# EAGLE design STM_BLOCK (EAGLE 8.6.1)
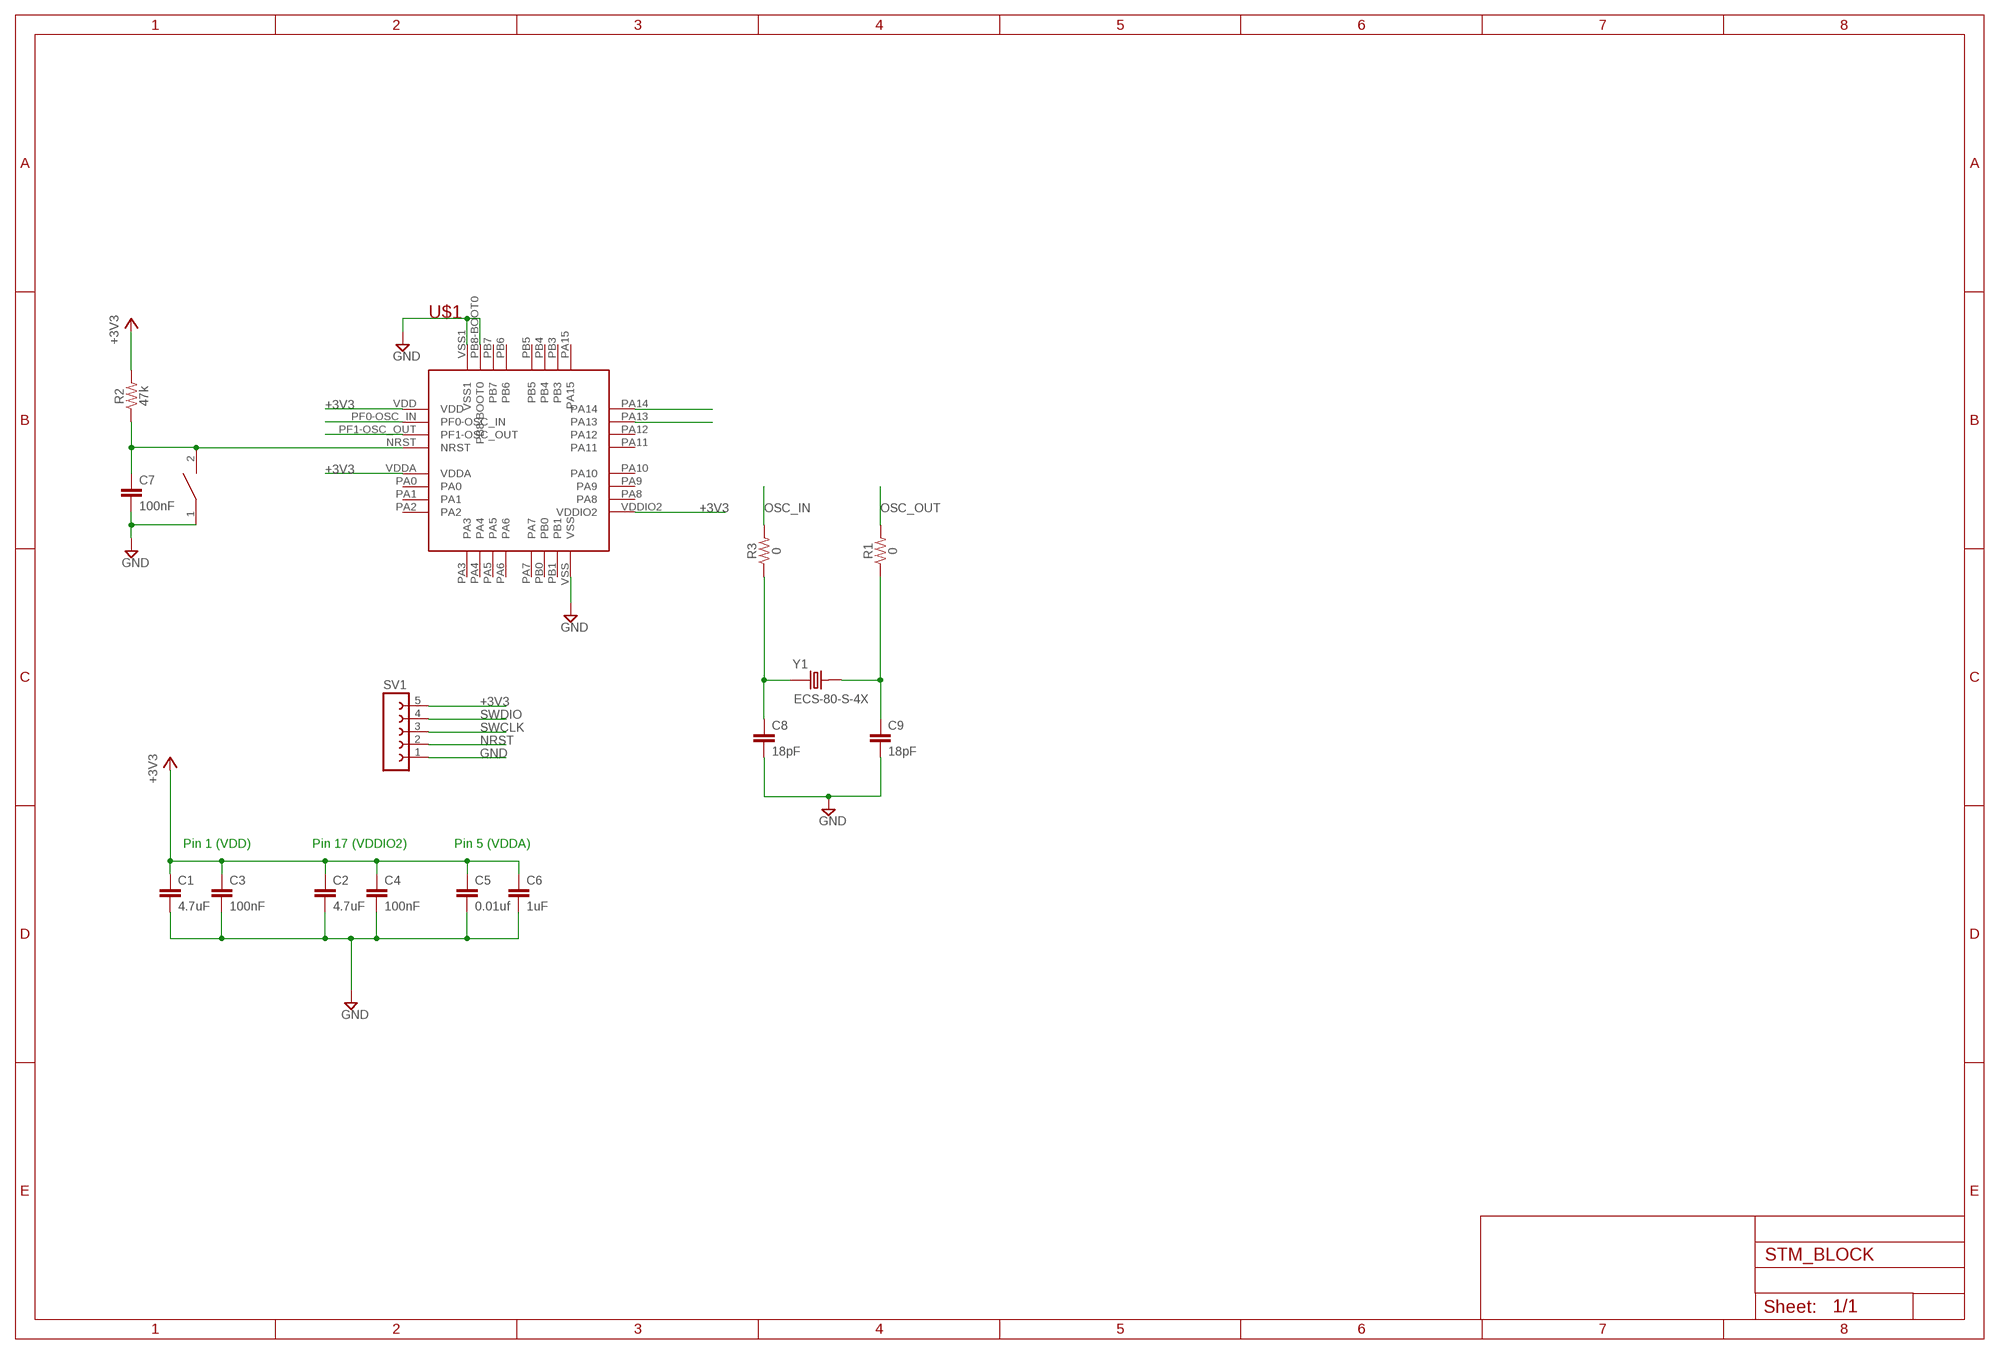
[diagram p0: schematic, sheet 1]

## Parts
C1  4.7uF  4.7UF0603  [0603]
C2  4.7uF  4.7UF0603  [0603]
C3  100nF  4.7UF0603  [0603]
C4  100nF  4.7UF0603  [0603]
C5  0.01uf  4.7UF0603  [0603]
C6  1uF  4.7UF0603  [0603]
C7  100nF  4.7UF0603  [0603]
C8  18pF  4.7UF0603  [0603]
C9  18pF  4.7UF0603  [0603]
R1  0  1KOHM-0603-1/10W-1%  [0603]
R2  47k  1KOHM-0603-1/10W-1%  [0603]
R3  0  1KOHM-0603-1/10W-1%  [0603]
RESET  SWITCH  [SW_2512]
SV1  FE05-1  [FE05-1]
U$1  STM32F042K6T6  [STM32F042K6T6]
Y1  ECS-80-S-4X  [XTAL_ECS-80-S-4X]

## Nets
+3V3: C1.1 C2.1 C3.1 C4.1 C5.1 C6.1 R2.2 SV1.5 U$1.VDD U$1.VDDA U$1.VDDIO2
GND: C1.2 C2.2 C3.2 C4.2 C5.2 C6.2 C7.2 C8.2 C9.2 RESET.1 SV1.1 U$1.PB8-BOOT0 U$1.VSS U$1.VSS1
N$1: C9.1 R1.1 Y1.2
N$2: C8.1 R3.1 Y1.1
NRST: C7.1 R2.1 RESET.2 SV1.2 U$1.NRST
OSC_IN: R3.2 U$1.PF0-OSC_IN
OSC_OUT: R1.2 U$1.PF1-OSC_OUT
SWCLK: SV1.3 U$1.PA14
SWDIO: SV1.4 U$1.PA13
Unconnected: U$1.PA0 U$1.PA1 U$1.PA2 U$1.PA3 U$1.PA4 U$1.PA5 U$1.PA6 U$1.PA7 U$1.PA8 U$1.PA9 U$1.PA10 U$1.PA11 U$1.PA12 U$1.PA15 U$1.PB0 U$1.PB1 U$1.PB3 U$1.PB4 U$1.PB5 U$1.PB6 U$1.PB7

## Notes on the sheet
- Pin 1 (VDD) | Pin 17 (VDDIO2) | Pin 5 (VDDA)

## Library data of the parts
C1 C2 = SparkFun-Capacitors:4.7UF: 4.7µF ceramic capacitors A capacitor is a passive two-terminal electrical component used to store electrical energy temporarily in an electric field.; PROD_ID: CAP-08280
C3-C9 = SparkFun-Capacitors:4.7UF: 4.7µF ceramic capacitors A capacitor is a passive two-terminal electrical component used to store electrical energy temporarily in an electric field.; PROD_ID: CAP-08280; VALUE: 4.7uF
R1-R3 = SparkFun-Resistors:1KOHM: 1kΩ resistor A resistor is a passive two-terminal electrical component that implements electrical resistance as a circuit element. Resistors act to reduce current flow, and, at the same time, act to lower voltage levels within circuits. - Wikipedia; PROD_ID: RES-07856; VALUE: 1k
RESET = DiscreteComponents:SWITCH
SV1 = con-lsta:FE05-1: FEMALE HEADER; OC_FARNELL: unknown; OC_NEWARK: unknown
U$1 = PI_Shield_Library:STM32F042K6T6
Y1 = ECS-80-S-4X:ECS-80-S-4X: CRYSTAL T/H; DESCRIPTION: Crystal 8MHz Series 2-Pin HC-49/U; DIGI-KEY_PART_NUMBER: X1057-ND; DIGI-KEY_PURCHASE_URL: https://www.digikey.com/product-detail/en/ecs-inc/ECS-80-S-4X/X1057-ND/827549?utm_source=snapeda&utm_medium=aggregator&utm_campaign=symbol; MF: ECS International; MP: ECS-80-S-4X; PACKAGE: HC-49/US ECS International

## Board
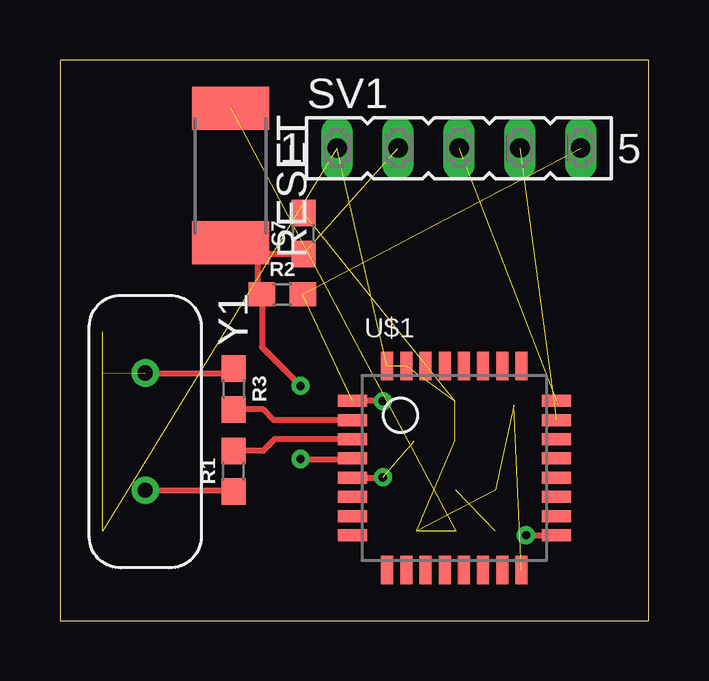
[diagram p1: board, top side]
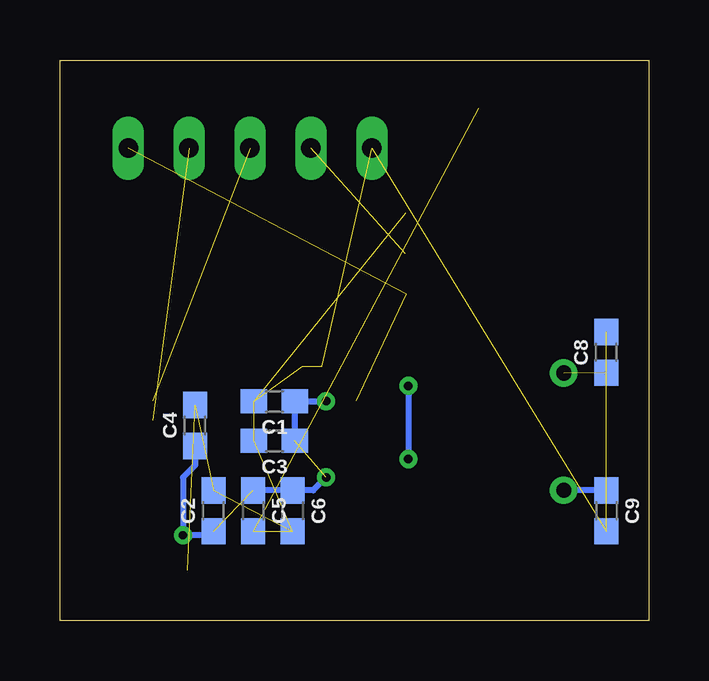
[diagram p2: board, bottom side, seen from below]

Size 24.56 x 23.36 mm. Coordinates in mm from the lower left corner, seen from the top.
Outline: 0,0 24.56,0 24.56,23.36 0,23.36 0,0
Copper layers (1*16): Top 0.035mm / dielectric 1.5mm / Bottom 0.035mm
Design rules "default": minimum track width 6mil, minimum drill 0.35mm, track to track 6mil, track to pad 6mil, pad to pad 6mil, via to via 6mil, smd to smd 6mil, copper to edge 40mil, drill to drill 6mil, minimum pad ring 10mil, minimum via ring 8mil, stop-mask expansion 4mil, vias tented up to drill 0mil, thermal gap 10mil

### Footprints (pad centres in the part's own frame; a part is rotated, then mirrored left to right if it is on the bottom)
0603 = smd 1.1 x 1: 1 -0.85,0; 2 0.85,0
SW_2512 = smd 1.8 x 3.2: 1 -2.8,0; 2 2.8,0
FE05-1 = drill 0.813 long: 1 -5.08,0; 2 -2.54,0; 3 0,0; 4 2.54,0; 5 5.08,0
STM32F042K6T6 = smd 1.2 x 0.5: NRST 0,3.2; PA0 0,1.6; PA1 0,0.8; PA2 0,0; PA8 8.5,0.8; PA9 8.5,1.6; PA10 8.5,2.4; PA11 8.5,3.2; PA12 8.5,4; PA13 8.5,4.8; PA14 8.5,5.6; PF0-OSC_IN 0,4.8; PF1-OSC_OUT 0,4; VDD 0,5.6; VDDA 0,2.4; VDDIO2 8.5,0 | smd 0.5 x 1.2: PA3 1.45,-1.45; PA4 2.25,-1.45; PA5 3.05,-1.45; PA6 3.85,-1.45; PA7 4.65,-1.45; PA15 7.05,7.05; PB0 5.45,-1.45; PB1 6.25,-1.45; PB3 6.25,7.05; PB4 5.45,7.05; PB5 4.65,7.05; PB6 3.85,7.05; PB7 3.05,7.05; PB8-BOOT0 2.25,7.05; VSS 7.05,-1.45; VSS1 1.45,7.05
XTAL_ECS-80-S-4X = drill 0.63 pad 1.03: 1 -2.44,0; 2 2.44,0

### Placement (x,y rotation side)
C1  15.62,9.14 180 bottom
C2  18.16,4.57 90 bottom
C3  15.62,7.49 180 bottom
C4  18.92,8.13 90 bottom
C5  16.51,4.57 270 bottom
C6  14.86,4.57 270 bottom
C7  10.16,16.13 90 top
C8  1.78,11.18 90 bottom
C9  1.78,4.57 270 bottom
R1  7.24,6.22 90 top
R2  9.27,13.59 0 top
R3  7.24,9.65 270 top
RESET  7.11,18.54 270 top
SV1  16.64,19.68 0 top
U$1  12.19,3.56 0 top
Y1  3.56,7.87 270 top

### Tracks (layer width: path | path; a pad name or v marks a point on that pad's centre or on a via)
+3V3  (via drill 0.35)  (4 unrouted)
  Top 0.254: v13.46,9.14 13.45,9.16 U$1.VDD | U$1.VDDA 13.45,5.96 v13.46,5.97 | v19.43,3.56 U$1.VDDIO2
  Bottom 0.254: v13.46,9.14 C1.1 C3.1 | v13.46,5.97 14.01,5.42 C6.1 C5.1 | C4.1 18.92,6.48 19.43,5.97 v19.43,3.56 18.33,3.56 C2.1
GND  (13 unrouted)
N$1
  Top 0.254: 3.58,5.46 Y1.2 7.18,5.43 R1.1
  Bottom 0.254: C9.1 3.54,5.42 Y1.2
N$2  (1 unrouted)
  Top 0.254: Y1.1 7.05,10.31 R3.1
NRST  (via drill 0.35)  (1 unrouted)
  Top 0.254: RESET.2 7.58,15.28 8.25,15.28 | 8.25,15.28 C7.1 | 8.25,15.28 8.25,13.75 R2.1 8.42,11.39 v10.03,9.78 | v10.03,6.73 12.17,6.73 U$1.NRST
  Bottom 0.254: v10.03,9.78 v10.03,6.73
OSC_IN
  Top 0.254: U$1.PF0-OSC_IN 8.92,8.36 8.47,8.8 R3.2
OSC_OUT
  Top 0.254: U$1.PF1-OSC_OUT 8.95,7.56 8.47,7.07 R1.2
SWCLK  (1 unrouted)
SWDIO  (1 unrouted)